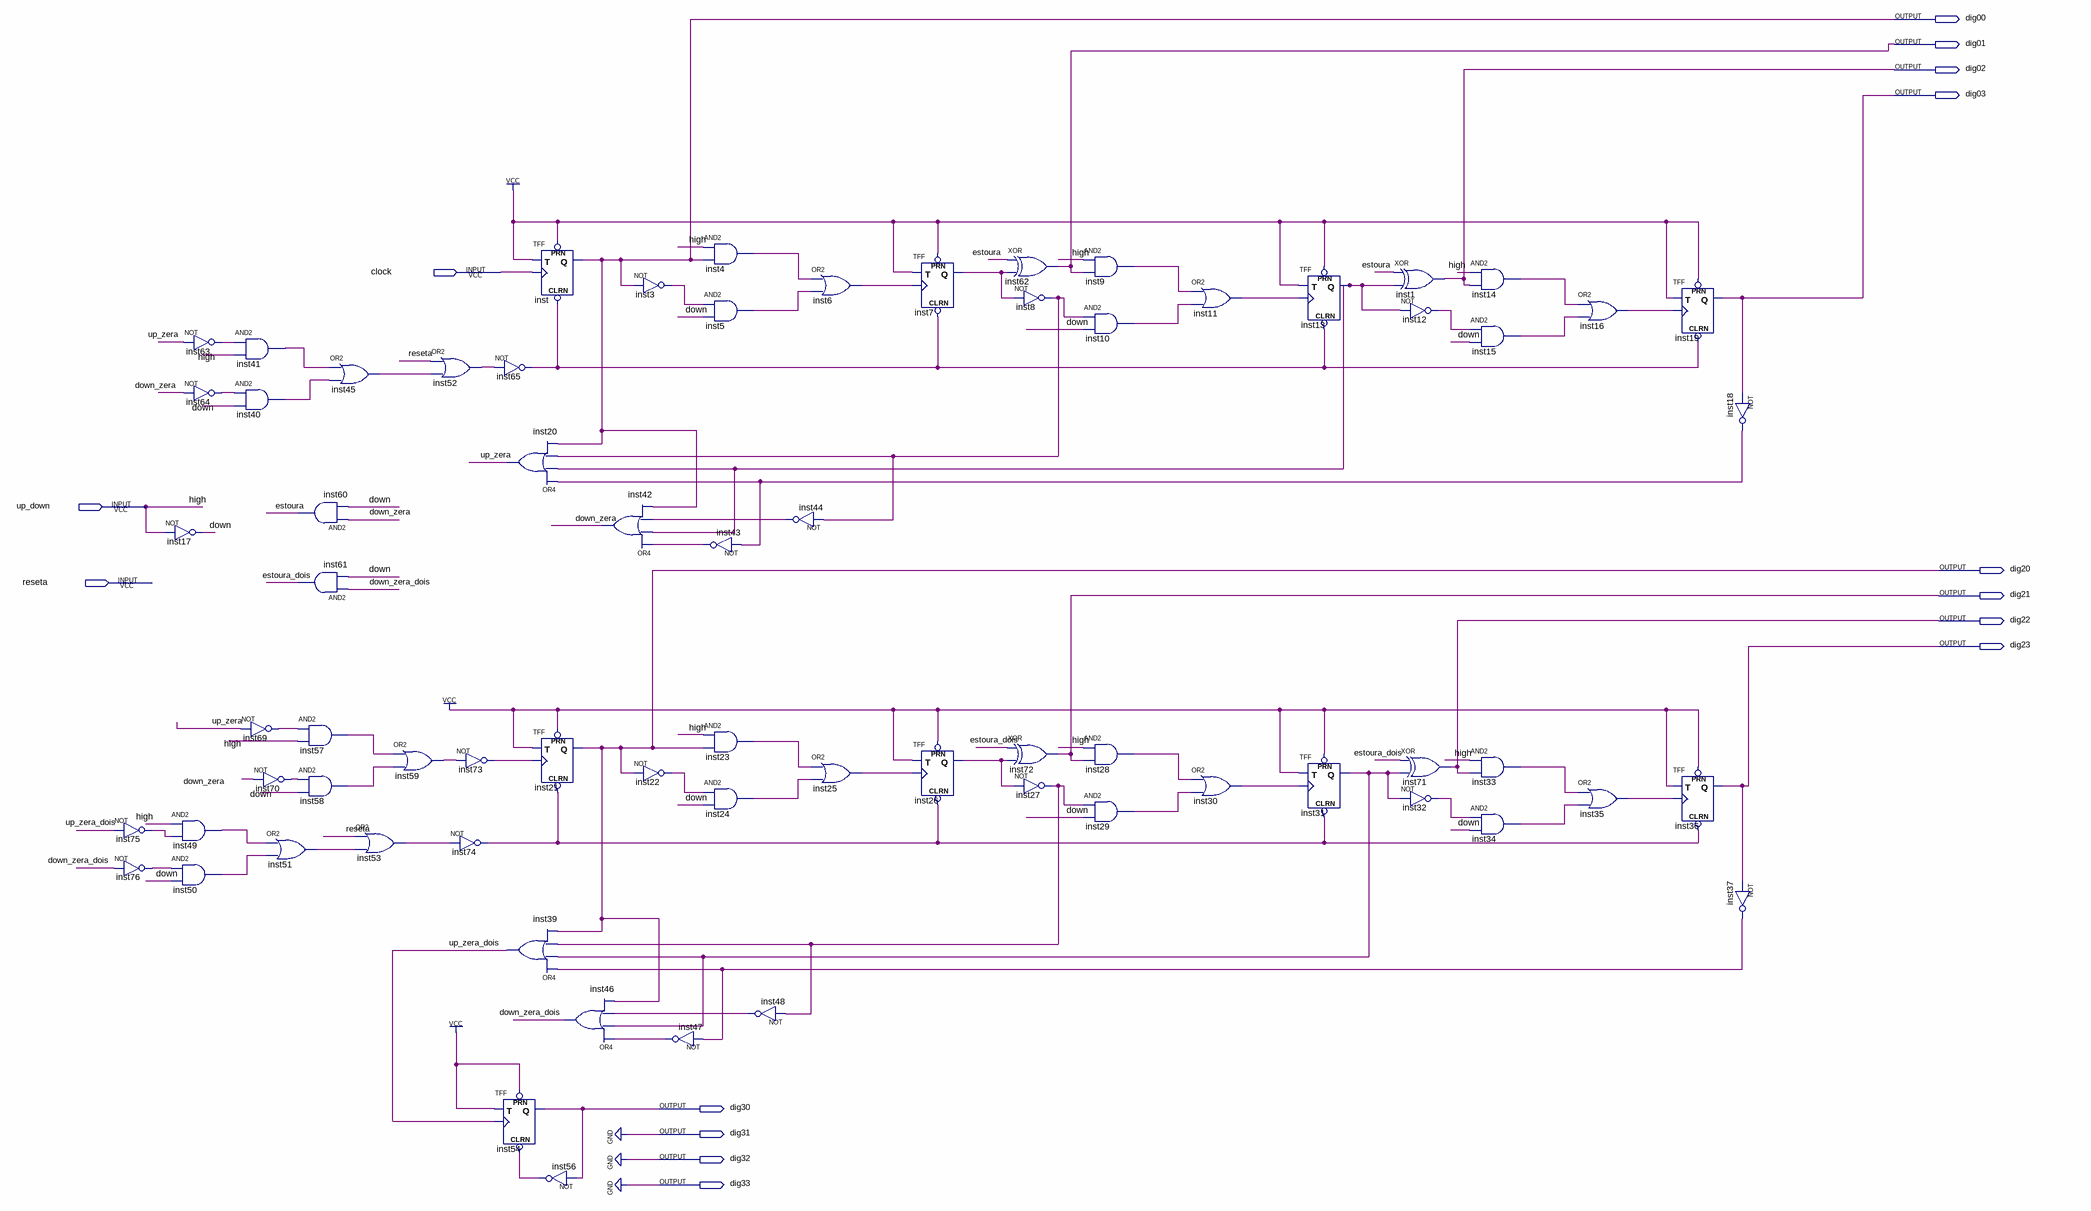
[diagram p0: schematic sheet]
// Quartus schematic contador_novo.bdf as structural Verilog: 71 symbols, 15 pins
module contador_novo (
  input  clock,
  input  up_down,
  input  reseta,
  output dig00,
  output dig01,
  output dig02,
  output dig03,
  output dig20,
  output dig21,
  output dig22,
  output dig23,
  output dig30,
  output dig31,
  output dig32,
  output dig33
);

  wire down, down_zera, down_zera_dois, estoura, estoura_dois, inst3_out, inst4_out, inst5_out, inst6_out,
       inst7_q, inst8_out, inst9_out, inst10_out, inst11_out, inst12_out, inst13_q, inst14_out, inst15_out,
       inst16_out, inst18_out, inst22_out, inst23_out, inst24_out, inst25_out, inst26_q, inst27_out,
       inst28_out, inst29_out, inst30_out, inst31_q, inst32_out, inst33_out, inst34_out, inst35_out,
       inst37_out, inst40_out, inst41_out, inst43_out, inst44_out, inst45_out, inst47_out, inst48_out,
       inst49_out, inst50_out, inst51_out, inst52_out, inst53_out, inst56_out, inst57_out, inst58_out,
       inst59_out, inst63_out, inst64_out, inst65_out, inst69_out, inst70_out, inst73_out, inst74_out,
       inst75_out, inst76_out, up_zera, up_zera_dois;

  not inst75 (inst75_out, up_zera_dois);
  not inst76 (inst76_out, down_zera_dois);
  not inst63 (inst63_out, up_zera);
  not inst64 (inst64_out, down_zera);
  not inst17 (down, up_down);
  and inst49 (inst49_out, up_down, inst75_out);
  and inst50 (inst50_out, inst76_out, down);
  and inst41 (inst41_out, inst63_out, up_down);
  and inst40 (inst40_out, inst64_out, down);
  not inst69 (inst69_out, up_zera);
  not inst70 (inst70_out, down_zera);
  and inst60 (estoura, down_zera, down);
  and inst61 (estoura_dois, down_zera_dois, down);
  and inst57 (inst57_out, inst69_out, up_down);
  and inst58 (inst58_out, inst70_out, down);
  or inst51 (inst51_out, inst49_out, inst50_out);
  or inst45 (inst45_out, inst41_out, inst40_out);
  or inst53 (inst53_out, reseta, inst51_out);
  or inst59 (inst59_out, inst57_out, inst58_out);
  or inst52 (inst52_out, reseta, inst45_out);
  not inst73 (inst73_out, inst59_out);
  not inst74 (inst74_out, inst53_out);
  not inst65 (inst65_out, inst52_out);
  or inst20 (up_zera, inst18_out, inst13_q, inst8_out, dig00);
  or inst39 (up_zera_dois, inst37_out, inst31_q, inst27_out, dig20);
  TFF inst54 (.PRN(1'b1), .CLRN(inst56_out), .T(1'b1), .CLK(up_zera_dois), .Q(dig30));
  TFF inst (.PRN(1'b1), .CLRN(inst65_out), .T(1'b1), .CLK(clock), .Q(dig00));
  TFF inst21 (.PRN(1'b1), .CLRN(inst74_out), .T(1'b1), .CLK(inst73_out), .Q(dig20));
  not inst56 (inst56_out, dig30);
  or inst42 (down_zera, inst43_out, inst13_q, inst44_out, dig00);
  or inst46 (down_zera_dois, inst47_out, inst31_q, inst48_out, dig20);
  not inst3 (inst3_out, dig00);
  not inst22 (inst22_out, dig20);
  and inst4 (inst4_out, up_down, dig00);
  and inst5 (inst5_out, inst3_out, down);
  not inst43 (inst43_out, inst18_out);
  and inst23 (inst23_out, up_down, dig20);
  and inst24 (inst24_out, inst22_out, down);
  not inst47 (inst47_out, inst37_out);
  not inst48 (inst48_out, inst27_out);
  or inst6 (inst6_out, inst4_out, inst5_out);
  not inst44 (inst44_out, inst8_out);
  or inst25 (inst25_out, inst23_out, inst24_out);
  TFF inst7 (.PRN(1'b1), .CLRN(inst65_out), .T(1'b1), .CLK(inst6_out), .Q(inst7_q));
  TFF inst26 (.PRN(1'b1), .CLRN(inst74_out), .T(1'b1), .CLK(inst25_out), .Q(inst26_q));
  xor inst62 (dig01, estoura, inst7_q);
  not inst8 (inst8_out, inst7_q);
  xor inst72 (dig21, estoura_dois, inst26_q);
  not inst27 (inst27_out, inst26_q);
  and inst9 (inst9_out, up_down, dig01);
  and inst10 (inst10_out, inst8_out, down);
  and inst28 (inst28_out, up_down, dig21);
  and inst29 (inst29_out, inst27_out, down);
  or inst11 (inst11_out, inst9_out, inst10_out);
  or inst30 (inst30_out, inst28_out, inst29_out);
  TFF inst13 (.PRN(1'b1), .CLRN(inst65_out), .T(1'b1), .CLK(inst11_out), .Q(inst13_q));
  TFF inst31 (.PRN(1'b1), .CLRN(inst74_out), .T(1'b1), .CLK(inst30_out), .Q(inst31_q));
  xor inst1 (dig02, estoura, inst13_q);
  not inst12 (inst12_out, inst13_q);
  xor inst71 (dig22, estoura_dois, inst31_q);
  not inst32 (inst32_out, inst31_q);
  and inst14 (inst14_out, up_down, dig02);
  and inst15 (inst15_out, inst12_out, down);
  and inst33 (inst33_out, up_down, dig22);
  and inst34 (inst34_out, inst32_out, down);
  or inst16 (inst16_out, inst14_out, inst15_out);
  or inst35 (inst35_out, inst33_out, inst34_out);
  TFF inst19 (.PRN(1'b1), .CLRN(inst65_out), .T(1'b1), .CLK(inst16_out), .Q(dig03));
  TFF inst36 (.PRN(1'b1), .CLRN(inst74_out), .T(1'b1), .CLK(inst35_out), .Q(dig23));
  not inst18 (inst18_out, dig03);
  not inst37 (inst37_out, dig23);

  assign dig31 = 1'b0;
  assign dig32 = 1'b0;
  assign dig33 = 1'b0;

  // Other names for the same wires on the sheet: high = up_down
endmodule
